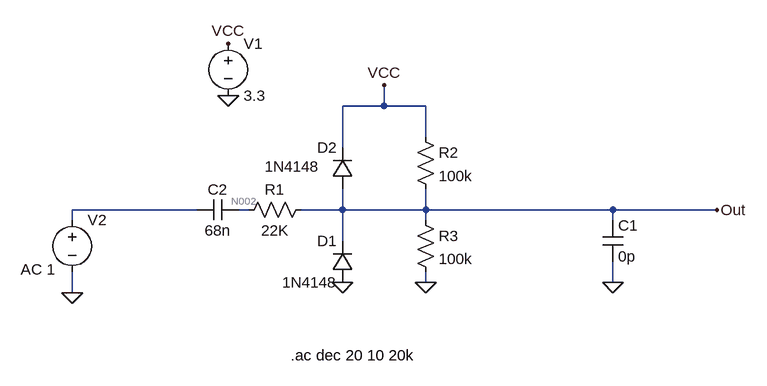
[diagram p0: schematic sim_frontend.asc]
sim_frontend.asc, the LTspice schematic file:
Version 4
SHEET 1 988 680
WIRE 416 -80 416 -112
WIRE 416 -80 352 -80
WIRE 480 -80 416 -80
WIRE 480 -32 480 -80
WIRE 352 -16 352 -80
WIRE 128 80 -64 80
WIRE 208 80 192 80
WIRE 352 80 352 48
WIRE 352 80 288 80
WIRE 480 80 480 48
WIRE 480 80 352 80
WIRE 768 80 480 80
WIRE 928 80 768 80
WIRE -64 96 -64 80
WIRE 480 96 480 80
WIRE 768 96 768 80
WIRE 352 128 352 80
WIRE 480 192 480 176
WIRE 768 192 768 160
WIRE -64 208 -64 176
FLAG -64 208 0
FLAG 352 192 0
FLAG 480 192 0
FLAG 928 80 Out
FLAG 768 192 0
FLAG 176 -96 0
FLAG 176 -176 VCC
FLAG 416 -112 VCC
SYMBOL res 304 64 R90
WINDOW 0 0 56 VBottom 2
WINDOW 3 32 56 VTop 2
SYMATTR InstName R1
SYMATTR Value 22K
SYMBOL diode 368 192 R180
WINDOW 0 24 64 Left 2
WINDOW 3 24 0 Left 2
SYMATTR InstName D1
SYMATTR Value 1N4148
SYMBOL diode 368 48 R180
WINDOW 0 24 64 Left 2
WINDOW 3 51 35 Left 2
SYMATTR InstName D2
SYMATTR Value 1N4148
SYMBOL res 464 -48 R0
SYMATTR InstName R2
SYMATTR Value 100k
SYMBOL res 464 80 R0
SYMATTR InstName R3
SYMATTR Value 100k
SYMBOL cap 752 96 R0
SYMATTR InstName C1
SYMATTR Value 0p
SYMBOL voltage 176 -192 R0
WINDOW 123 0 0 Left 0
WINDOW 39 0 0 Left 0
SYMATTR InstName V1
SYMATTR Value 3.3
SYMBOL voltage -64 80 R0
WINDOW 3 -79 92 Left 2
WINDOW 123 0 0 Left 0
WINDOW 39 0 0 Left 0
SYMATTR Value AC 1
SYMATTR InstName V2
SYMBOL cap 192 64 R90
WINDOW 0 0 32 VBottom 2
WINDOW 3 32 32 VTop 2
SYMATTR InstName C2
SYMATTR Value 68n
TEXT 272 304 Left 2 !.ac dec 20 10 20k

The netlist it stands for:
* sim_frontend.asc
R1 Out N002 22K
D1 0 Out 1N4148
D2 Out VCC 1N4148
R2 VCC Out 100k
R3 Out 0 100k
C1 Out 0 0p
V1 VCC 0 3.3
V2 N001 0 AC 1
C2 N002 N001 68n
.model D D
.lib standard.dio
.ac dec 20 10 20k
.backanno
.end

* Results of the author's LTspice run, read from the files saved beside the schematic
* Operating Point, zero values left out:
*   V(out) = 1.65 V
*   V(n002) = 1.65 V
*   V(vcc) = 3.3 V
*   I(D1) = -2.522 nA
*   I(D2) = -2.522 nA
*   I(R2) = 16.5 µA
*   I(R3) = 16.5 µA
*   I(V1) = -16.5 µA
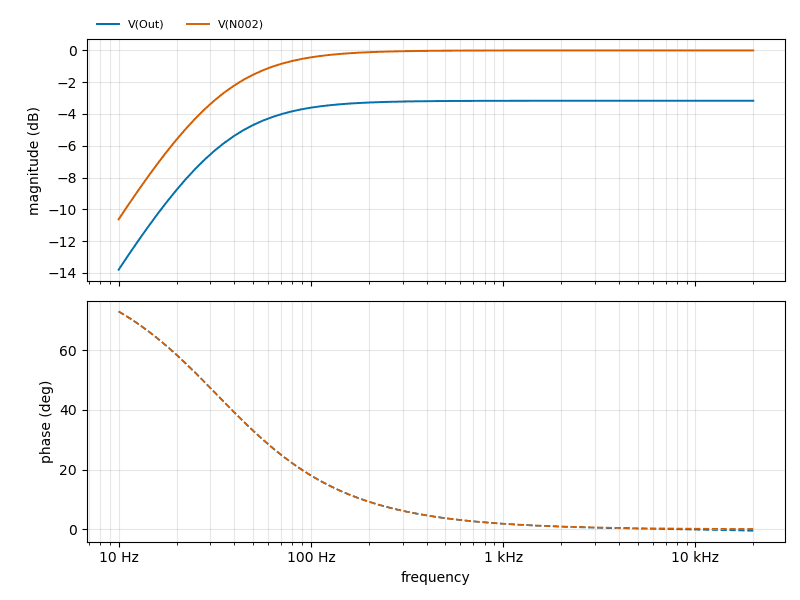
[diagram p1: AC Analysis of sim_frontend.asc, plotted from the saved traces]
* AC Analysis, 1 run:
*   V(Out): -13.80 dB at 10 Hz, -3.17 dB at 20 kHz, peak -3.17 dB at 7.943 kHz, 3 dB below the peak at 32.55 Hz
*   V(N002): -10.63 dB at 10 Hz, -0.00 dB at 20 kHz, peak -0.00 dB at 20 kHz, 3 dB below the peak at 32.55 Hz